# Altium project ELoad Control Assembly Gen 2.PrjPcb
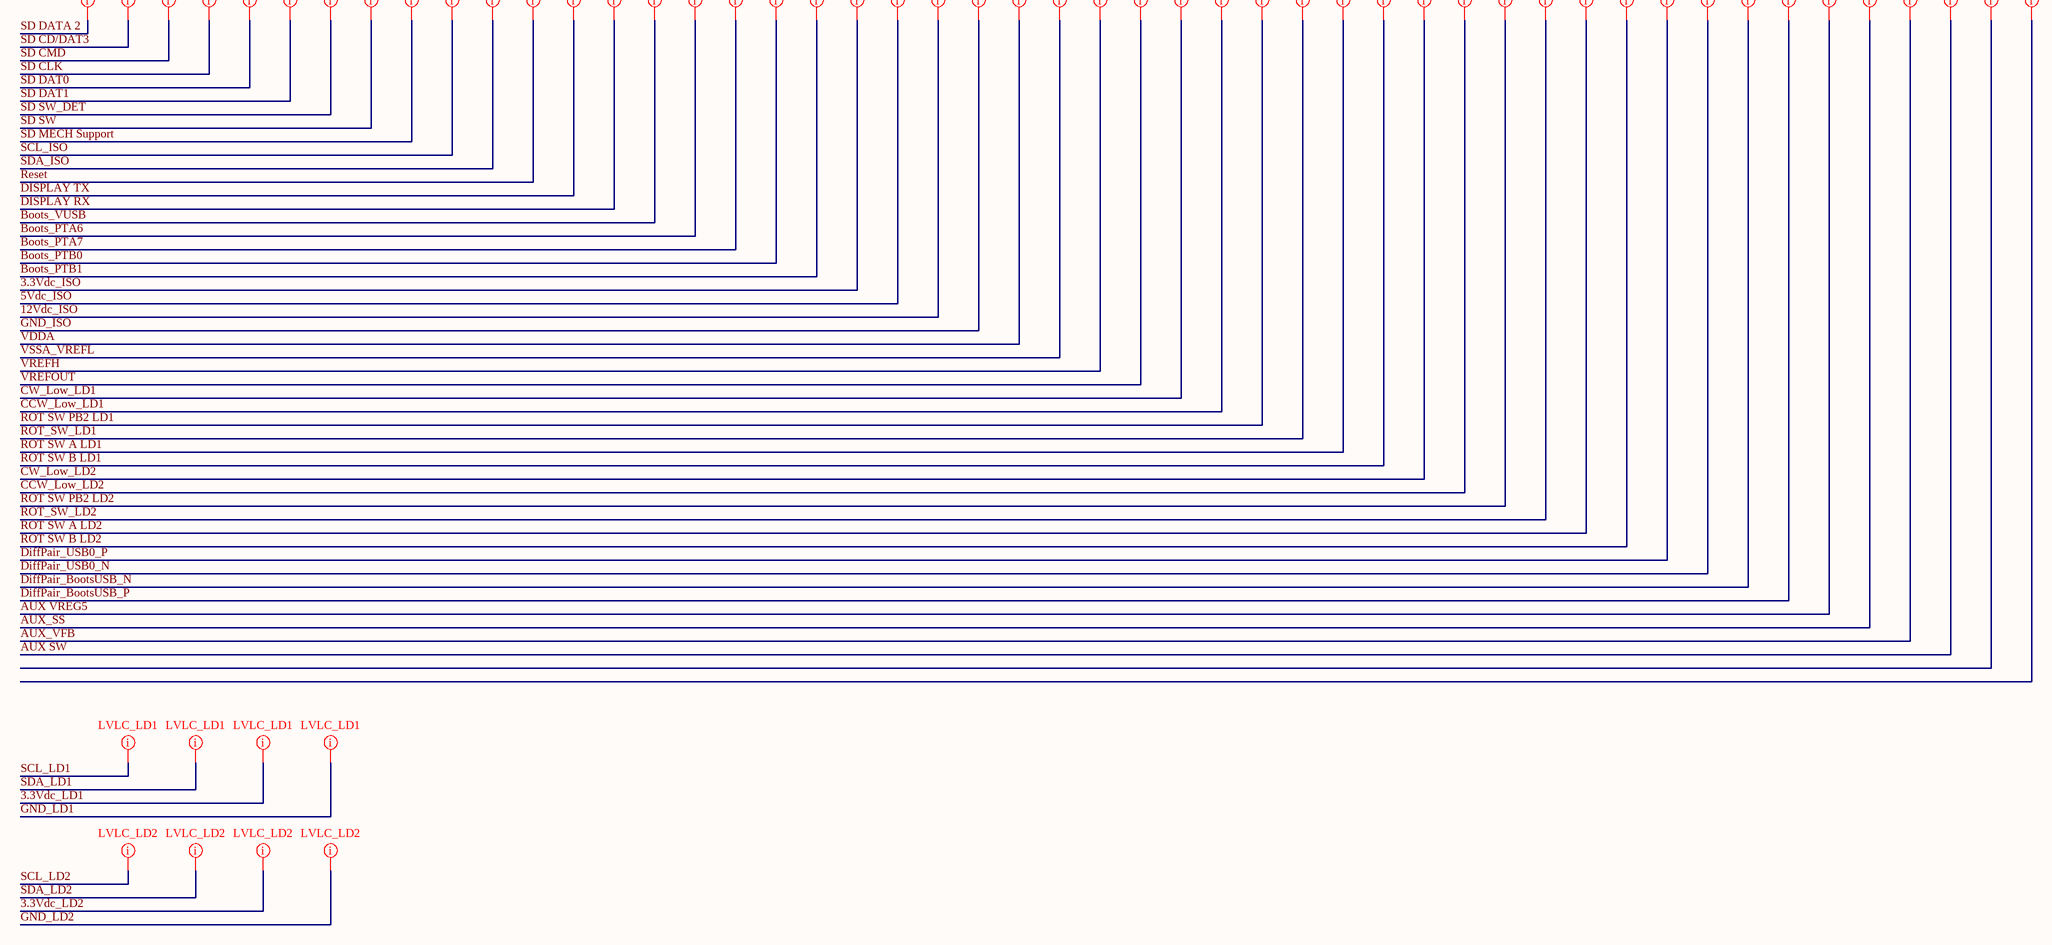
[diagram p0: ELoad Control Assembly Gen 2 - Net Classes.SchDoc]
2 sheets, 18 parts. Net scope: global (net labels, ports and power ports of the same name join across sheets).
Sheets:
  ELoad Control Assembly Gen 2 - Net Classes.SchDoc
  ELoad Control Assembly Gen 2 - PSU.SchDoc

## Sheet ELoad Control Assembly Gen 2 - Net Classes.SchDoc
size C

### Layout directives
net class Low Volt; net class Low Current: 3.3Vdc_ISO, 5Vdc_ISO, 12Vdc_ISO, (no net found under the mark), AUX SW, AUX VREG5, AUX_SS, AUX_VFB, Boots_PTA6, Boots_PTA7, Boots_PTB0, Boots_PTB1, Boots_VUSB, CCW_Low_LD1, CCW_Low_LD2, CW_Low_LD1, CW_Low_LD2, DISPLAY RX, DISPLAY TX, GND_ISO, Reset, ROT SW A LD1, ROT SW A LD2, ROT SW B LD1, ROT SW B LD2, ROT SW PB2 LD1, ROT SW PB2 LD2, ROT_SW_LD1, ROT_SW_LD2, SCL_ISO, SD CD/DAT3, SD CLK, SD CMD, SD DAT0, SD DAT1, SD DATA 2, SD MECH Support, SD SW, SD SW_DET, SDA_ISO, VDDA, VREFH, VREFOUT, VSSA_VREFL
net class Low Volt; net class Low Current; net class HS_DiffPair: DiffPair_BootsUSB_N, DiffPair_BootsUSB_P, DiffPair_USB0_N, DiffPair_USB0_P
net class Low Volt LD1; net class Low Current: 3.3Vdc_LD1, GND_LD1, SCL_LD1, SDA_LD1
net class Low Volt LD2; net class Low Current: 3.3Vdc_LD2, GND_LD2, SCL_LD2, SDA_LD2

## Sheet ELoad Control Assembly Gen 2 - PSU.SchDoc
size B
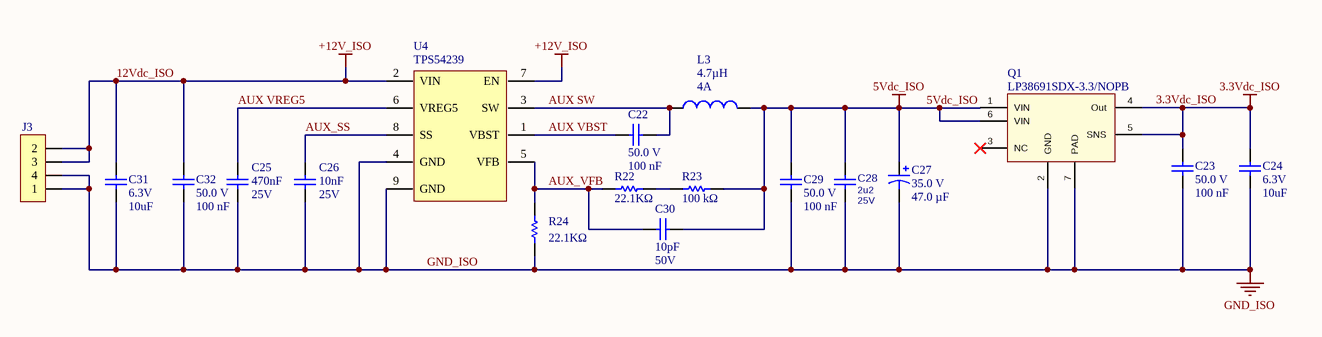
[diagram p1: ELoad Control Assembly Gen 2 - PSU.SchDoc]

### Parts
C22  Voltage Rating (DC): 50.0 V  Capacitance: 100 nF  [Cap,0805]  (hidden comment: Cap)
C23  Voltage Rating (DC): 50.0 V  Capacitance: 100 nF  [Cap,0805]  (hidden comment: Cap)
C24  Voltage - Rated: 6.3V  Capacitance: 10uF  [Cap,0805]  (hidden comment: Cap)
C25  Voltage Rating (DC): 25V  Capacitance: 470nF  [Cap,0805]  (hidden comment: Cap)
C26  Voltage Rating (DC): 25V  Capacitance: 10nF  [Cap,0805]  (hidden comment: Cap)
C27  Voltage Rating (DC): 35.0 V  Capacitance: 47.0 µF  [Cap, SMD, polerized, 5mm spacing]  (hidden comment: Nichicon UCW1V470MCL1GS)
C28  2u2  Voltage: 25V  [res, 0805, HD]  (net tie)
C29  Voltage Rating (DC): 50.0 V  Capacitance: 100 nF  [Cap,0805]  (hidden comment: Cap)
C30  Capacitance: 10pF  Voltage - Rated: 50V  [CAP, 0805, HD]  (hidden comment: CL21C100JBANNNC)
C31  Voltage - Rated: 6.3V  Capacitance: 10uF  [Cap,0805]  (hidden comment: Cap)
C32  Voltage Rating (DC): 50.0 V  Capacitance: 100 nF  [Cap,0805]  (hidden comment: Cap)
J3  0022112042  [conn, molex, 0.1", 4 pin]  (value not drawn)
L3  Inductance: 4.7µH  Current Rating (Amps): 4A  [Ind,Non-Stand,Murata,1255AY]  (hidden comment: 1255AY-4R7M=P3)
Q1  LP38691SDX-3.3/NOPB  [6-WSON (3x3)]
R22  Resistance: 22.1KΩ  [res, 0805, HD]  (hidden comment: RC0805FR-0722K1L)
R23  Resistance: 100 kΩ  [res, 0805, HD]  (hidden comment: Res,0805,100kΩ,1%,100ppm,CRCW0805100KFKEA)
R24  Resistance: 22.1KΩ  [res, 0805, HD]  (hidden comment: RC0805FR-0722K1L)
U4  TPS54239  [SOIC-8 PowerPad(pin4)]

### Nets
3.3Vdc_ISO: C23.2 C24.2 Q1.4(Out) Q1.5(SNS)
5Vdc_ISO: C27.1 C28.2 C29.2 C30.1 L3.2 Q1.1(VIN) Q1.6(VIN) R23.1
12Vdc_ISO: C31.2 C32.2 J3.2 J3.3 U4.2(VIN) U4.7(EN)  [also labelled +12V_ISO]
GND_ISO: C23.1 C24.1 C25.1 C26.1 C27.2 C28.1 C29.1 C31.1 C32.1 J3.1 J3.4 Q1.2(GND) Q1.7(PAD) R24.1 U4.4(GND) U4.9(GND)
AUX SW: C22.1 L3.1 U4.3(SW)
AUX VBST: C22.2 U4.1(VBST)
AUX VREG5: C25.2 U4.6(VREG5)
AUX_SS: C26.2 U4.8(SS)
AUX_VFB: C30.2 R22.1 R24.2 U4.5(VFB)
NetR22_2: R22.2 R23.2

Not connected (* = marked no-connect by the designer): Q1 3(NC)*

### Library data of the parts
C22 C23 C29 C32 = Cap,0805,100nf,50V,5%,08055C104JAT2A: Capacitor; Ceramic; Cap 0.1 uF; Tol 5%; Vol-Rtg 50 VDC; SMT; 0805; X7R; Tape & Reel; Lead-Free Status: Lead Free; Case/Package (SI): 2012; Insulation Resistance: 100 GΩ; Detailed Description: 0.1µF ±5% 50V Ceramic Capacitor X7R 0805 (2012 Metric); Mounting Style: Surface Mount; Packaging: Tape & Reel (TR), Cut Tape (CT); RoHS: Compliant; Size-Width: 1.24 mm; Case/Package: 0805; Number of Pins: 2; digikey url: http://www.digikey.ca/product-detail/en/avx-corporation/08055C104JAT2A/478-3352-1-ND/930144; REACH SVHC Compliance: No SVHC; Dielectric Characteristic: X7R; Capacitance Tolerance: ±5%; Size-Length: 2.01 mm; Size-Height: 710 µm; Size-Thickness: 940 µm; Manufacturer Part Number: 08055C104JAT2A; Octopart URL: http://octopart.com/08055c104jat2a-avx-55388010; Operating Temperature: -55°C ~ 125°C
C24 C31 = Cap,0805,10uf,6.3V,10%,CL21A106KQFNNNG: CL21 Series 10 uF 6.3V ±10 % Tolerance X5R SMT Multilayer Ceramic Capacitor; Lead-Free Status: Lead Free; Tolerance: ±10%; Other Names: 1276-6457-2; RoHS: Compliant; mfg P/N: CL21A106KQFNNNG; Mounting Style: Surface Mount; Operating Temperature: -55°C ~ 85°C; Applications: General Purpose; Package / Case: 0805 (2012 Metric)
C25 = Cap,0805,470nf,25V,10%,CGA4J2X7R1E474K125AA: 0.47µF ±10% 25V Ceramic Capacitor X7R 0805 (2012 Metric); Manufacturer: TDK Corporation; Lead-Free Status: Lead Free; Case/Package (SI): 2012; Mounting Style: Surface Mount; Packaging: Tape & Reel (TR), Cut Tape (CT); RoHS: Compliant; Size-Width: 1.24 mm; Case/Package: 0805; Number of Pins: 2; REACH SVHC Compliance: No SVHC; Dielectric Characteristic: X7R; Capacitance Tolerance: ±10%; Size-Length: 2.01 mm; Size-Height: 710 µm; Size-Thickness: 940 µm; mfg P/N: CGA4J2X7R1E474K125AA; Ratings: AEC-Q200
C26 = Cap,0805,10nF,±10%,25Vdc: CAP CER 10000PF 25V X7R 0805; Manufacturer: Samsung Electro-Mechanics; Capacitance Tolerance: ±10%; Dielectric Material: Ceramic; Lead-Free Status: Lead Free; mfg P/N: C0805X102J1GACAUTO; Case/Package: 0805; Mounting Style: Surface Mount; REACH SVHC Compliance: No SVHC; RoHS: Compliant; Applications: General Purpose; Operating Temperature: -55°C ~ 125°C; Temperature Coefficient: X7R; Series: CL
C27 = Cap, Polar,SMD, 47uF,35V,UCW1V470MCL1GS: 47uF 35 V dc Aluminium Electrolytic Capacitor, CW Series 7000h 6.3(Dia.)x8.7mm; Capacitance Tolerance: ±20%; Octopart URL: http://octopart.com/ucw1v470mcl1gs-nichicon-19717421; Manufacturer Part Number: UCW1V470MCL1GS; Size-Height: 8.70 mm; RoHS: Compliant; Mounting Style: Surface Mount; Size-Diameter: 6.30 mm; OctopartID: d4591c7f2c120b9e
C28 = Cap,0805,2.2uF,10%,25V: Cap,SMD,MLCC,2.2uF 25V X7R 10%,0805; Manufacturer: Murata; Manufacturer P/N: GRM21BR71E225KA73L (t&r, 3Kpcs); P/N: 211-121-19; iPS: 951-22501-R1; Not Stuffed: N/S; Temperature Category: -55~125 degC.; Fast Supplier: Digi-Key; Fast Supplier P/N: 490-3331-1-ND; Type: X7R
C30 = Cap,0805,10pf,±5%,C0G, NP0,CL21C100JBANNNC: CAP CER 10PF 50V C0G/NP0 0805; Manufacturer: Samsung Electro-Mechanics; Detailed Description: 10pF ±5% 50V Ceramic Capacitor C0G, NP0 0805 (2012 Metric); Categories: Capacitors   Ceramic Capacitors; Tolerance: ±5%; mfg P/N: CL21C100JBANNNC; Series: CL; Packaging: Tape & Reel (TR); Part Status: Active; Temperature Coefficient: C0G, NP0; Operating Temperature: -55°C ~ 125°C; Applications: General Purpose; Mounting Type: Surface Mount, MLCC; Package / Case: 0805 (2012 Metric); Size / Dimension: 0.079" L x 0.049" W (2.00mm x 1.25mm); Thickness (Max): 0.030" (0.75mm)
J3 = Connector,Through Hole,Molex,2.54mm,4Pin,Vert: Connector Header Through Hole 4 position 0.100" (2.54mm); Manufacturer: Molex; Number of Positions: 4; Number of Positions Loaded: All; Style: Board to Board or Cable; Shrouding: Shrouded - 1 Wall; Contact Length - Mating: 0.295" (7.49mm); Contact Length - Post: 0.140" (3.56mm); Overall Contact Length: 0.560" (14.22mm); Material Flammability Rating: UL94 V-0; p/n: 0022112042; Connector Type: Header; Contact Type: Male Pin; Pitch - Mating: 0.100" (2.54mm); Number of Rows: 1; Mounting Type: Through Hole; Termination: Solder; Fastening Type: Friction Lock; Insulation Height: 0.322" (8.18mm); Contact Shape: Square; Contact Finish - Mating: Gold; Contact Finish Thickness - Mating: 20.0µin (0.51µm); Contact Finish - Post: Tin; Contact Material: Brass; Insulation Material: Polyamide (PA), Nylon; Insulation Color: White; Contact Finish Thickness - Post: 100.0µin (2.54µm); Applications: Automotive, General Purpose, Medical, Telecommunications
L3 = IND,NON-Stand,SMD,4.7uH,4.5A,27.6mOhm,1255AY-4R7M=P3: FIXED IND 4.7UH 4.5A 27.6 MOHM; Manufacturer: Murata Electronics North America; Detailed Description: 4.7µH Shielded Wirewound Inductor 4A 27.6mOhm Max Nonstandard; Type: Wirewound; Material - Core: Ferrite; Tolerance: ±20%; Shielding: Shielded; DC Resistance (DCR): 27.6mOhm Max; Inductance Frequency - Test: 100kHz; mfg P/N: 1255AY-4R7M=P3; Part Status: Active; Current - Saturation: 4.5A; Mounting Type: Surface Mount; Package / Case: Nonstandard; Size / Dimension: 0.248" L x 0.248" W (6.30mm x 6.30mm); Height - Seated (Max): 0.177" (4.50mm)
Q1 = Reg,Linear,Fixed,500mA,10Vin_Max,3.3Vdc,LP38691SD-ADJ/NOPB: IC REG LIN POS ADJ 500MA 6WSON; Manufacturer: Texas Instruments; Output: Configuration Positive; Output Type: Fixed; Number of Regulators: 1; Current - Quiescent: (Iq) 55µA; Current - Supply (Max): 100µA; Detailed Description: Linear Voltage Regulator IC 1 Output 500mA 6-WSON (3x3); Categories: Integrated Circuits (ICs)   PMIC - Voltage Regulators - Linear; Voltage - Input (Max): 10V; Voltage - Output (Min/Fixed): 3.3V; Voltage - Output (Max): 9V; PSRR: 55dB (120Hz); Protection Features: Over Temperature; Voltage Dropout (Max): 0.55V @ 500mA; Series: Automotive, AEC-Q100; Mounting Type: Surface Mount; Package / Case: 6-WDFN Exposed Pad; Supplier Device Package: 6-WSON (3x3); mfg P/N: LP38691SDX-3.3/NOPB; Part Status: Active; Current - Output: 500mA; Operating Temperature: -40°C ~ 125°C; Base Part Number: LP38691
R22 R24 = Res,0805,22.1K,1%,100ppm,RC0805FR-0722K1L: 22.1 kOhms ±1% 0.125W, 1/8W Chip Resistor 0805 (2012 Metric) Moisture Resistant Thick Film; Case/Package (SI): 2012; Temperature Coefficient: 100.0 ppm/°C; Voltage Rating (DC): 150.0 V; Case/Package: 0805; Mounting Style: Surface Mount; Number of Pins: 2; Power Rating: 0.125 W; Resistance Tolerance: ±1%; Size-Height: 0.00045 m; Size-Length: 0.002 m; Size-Width: 0.00125 m; Features: Moisture Resistant; Operating Temperature: -55°C ~ 155°C
R23 = Res,0805,100kΩ,1%,100ppm,CRCW0805100KFKEA: 100 kOhms ±1% 0.125W, 1/8W Chip Resistor 0805 (2012 Metric) Thick Film; Manufacturer: Vishay; Lead-Free Status: Lead Free; Case/Package (SI): 2012; Power Rating: 125 mW; Temperature Coefficient: -100 ppm/°C to 100 ppm/°C; Resistance Tolerance: ±1%; RoHS: Compliant; Manufacturer Part Number: CRCW0805100KFKEA; Number of Pins: 2; Size-Length: 2.00 mm; Packaging: Tape & Reel (TR), Reel, Cut Tape (CT); Size-Height: 450 µm; Case/Package: 0805; Size-Width: 1.25 mm; Operating Temperature: 150 °C (max); Supplier 1 Part Number: 679-0803; Supplier 1: RS
U4 = Reg, Switching, Buck,23-4.5Vdcin,2A,TPS54239EDDAR: Buck Switching Regulator IC Positive Adjustable 0.76V 1 Output 2A 8-PowerSOIC (0.154", 3.90mm Width); Function: Step-Down; Number of Outputs: 1; Voltage - Input (Min): 4.5V; Voltage - Input (Max): 23V; Voltage - Output (Max): 7V; Frequency - Switching: 600kHz; Synchronous Rectifier: Yes; mfg P/N: TPS54239EDDAR; Output Configuration: Positive; Topology: Buck; Output Type: Adjustable; Voltage - Output (Min/Fixed): 0.76V; Current - Output: 2A; Operating Temperature: -40°C ~ 85°C (TA); Mounting Type: Surface Mount; Package / Case: 8-PowerSOIC (0.154", 3.90mm Width); Supplier Device Package: 8-SO PowerPad; Base Part Number: TPS54239